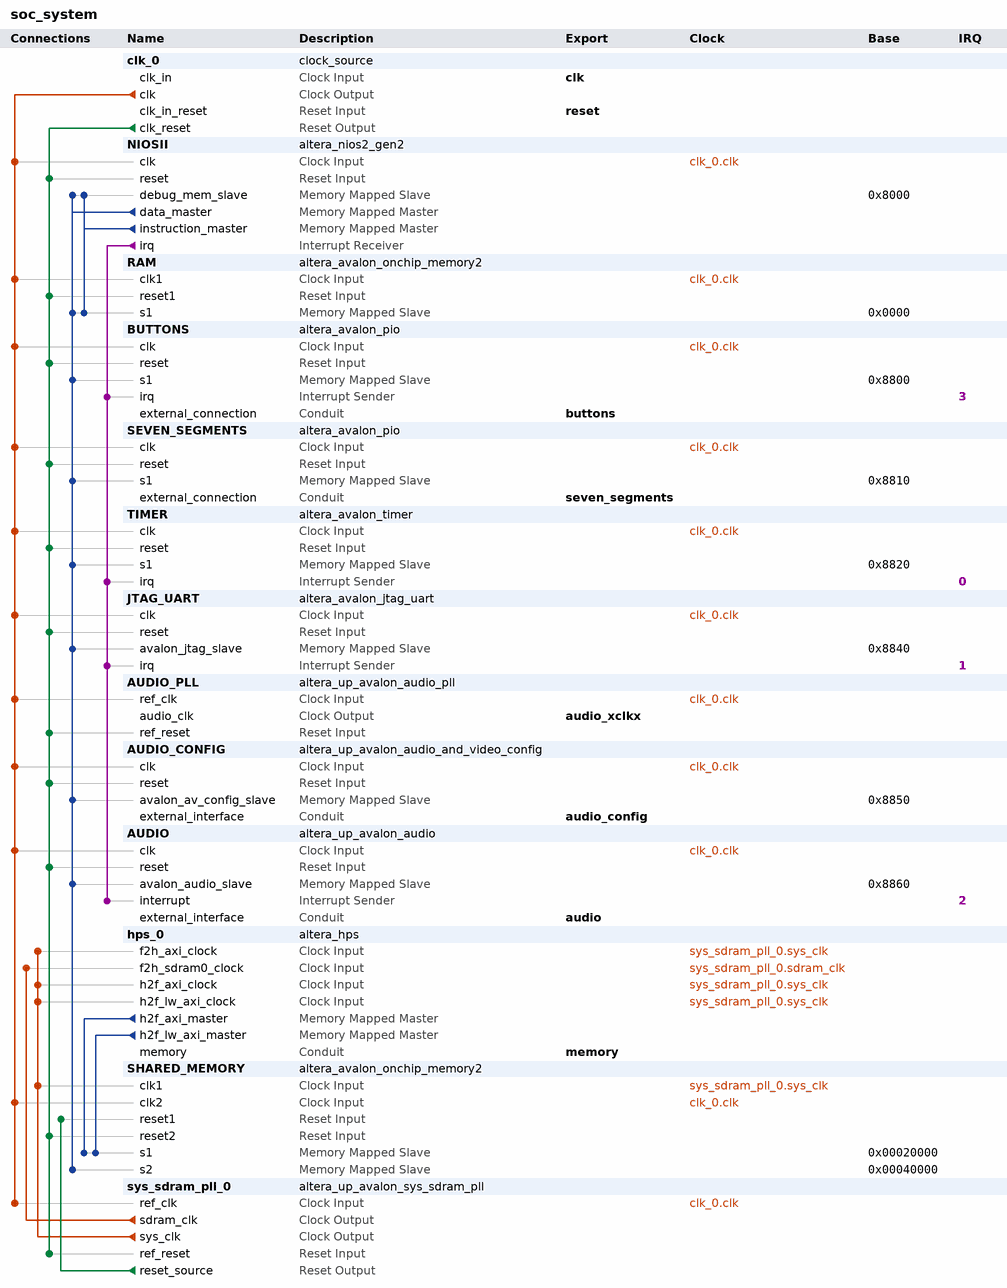
[diagram p0: system contents]
# Platform Designer (Qsys) system soc_system, Cyclone V 5CSEMA5F31C6
# Parameters at their usual value, and those the tool derives, are not listed.
package require -exact qsys 18.1
create_system soc_system
set_project_property DEVICE_FAMILY {Cyclone V}
set_project_property DEVICE 5CSEMA5F31C6

add_instance clk_0 clock_source 18.1
set_instance_parameter_value clk_0 clockFrequency 50000000

add_instance NIOSII altera_nios2_gen2 18.1
set_instance_parameter_value NIOSII dcache_size 2048
set_instance_parameter_value NIOSII exceptionSlave RAM.s1
set_instance_parameter_value NIOSII icache_size 4096
set_instance_parameter_value NIOSII impl Tiny
set_instance_parameter_value NIOSII resetSlave RAM.s1

add_instance RAM altera_avalon_onchip_memory2 18.1
set_instance_parameter_value RAM dataWidth 32
set_instance_parameter_value RAM dualPort false
set_instance_parameter_value RAM initMemContent true
set_instance_parameter_value RAM initializationFileName onchip_mem.hex
set_instance_parameter_value RAM memorySize 32768

add_instance BUTTONS altera_avalon_pio 18.1
set_instance_parameter_value BUTTONS bitClearingEdgeCapReg true
set_instance_parameter_value BUTTONS captureEdge true
set_instance_parameter_value BUTTONS direction Input
set_instance_parameter_value BUTTONS edgeType FALLING
set_instance_parameter_value BUTTONS generateIRQ true
set_instance_parameter_value BUTTONS irqType EDGE
set_instance_parameter_value BUTTONS width 3

add_instance SEVEN_SEGMENTS altera_avalon_pio 18.1
set_instance_parameter_value SEVEN_SEGMENTS direction Output
set_instance_parameter_value SEVEN_SEGMENTS width 28

add_instance TIMER altera_avalon_timer 18.1
set_instance_parameter_value TIMER fixedPeriod true
set_instance_parameter_value TIMER period 500
set_instance_parameter_value TIMER periodUnits MSEC

add_instance JTAG_UART altera_avalon_jtag_uart 18.1
set_instance_parameter_value JTAG_UART simInteractiveOptions NO_INTERACTIVE_WINDOWS

add_instance AUDIO_PLL altera_up_avalon_audio_pll 18.0
set_instance_parameter_value AUDIO_PLL gui_refclk 50.0

add_instance AUDIO_CONFIG altera_up_avalon_audio_and_video_config 18.0
set_instance_parameter_value AUDIO_CONFIG audio_in {Microphone to ADC}
set_instance_parameter_value AUDIO_CONFIG bit_length 24
set_instance_parameter_value AUDIO_CONFIG board DE1-SoC
set_instance_parameter_value AUDIO_CONFIG line_in_bypass false
set_instance_parameter_value AUDIO_CONFIG sampling_rate {48 kHz}

add_instance AUDIO altera_up_avalon_audio 18.0
set_instance_parameter_value AUDIO audio_in false
set_instance_parameter_value AUDIO avalon_bus_type {Memory Mapped}
set_instance_parameter_value AUDIO dw 24

add_instance hps_0 altera_hps 18.1
set_instance_parameter_value hps_0 EMAC1_Mode N/A
set_instance_parameter_value hps_0 EMAC1_PinMuxing Unused
set_instance_parameter_value hps_0 F2SCLK_COLDRST_Enable false
set_instance_parameter_value hps_0 F2SCLK_DBGRST_Enable false
set_instance_parameter_value hps_0 F2SCLK_WARMRST_Enable false
set_instance_parameter_value hps_0 F2SDRAM_Type AXI-3
set_instance_parameter_value hps_0 F2SDRAM_Width 64
set_instance_parameter_value hps_0 F2SINTERRUPT_Enable false
set_instance_parameter_value hps_0 F2S_Width 2
set_instance_parameter_value hps_0 FPGA_PERIPHERAL_OUTPUT_CLOCK_FREQ_EMAC0_GTX_CLK 125
set_instance_parameter_value hps_0 FPGA_PERIPHERAL_OUTPUT_CLOCK_FREQ_EMAC0_MD_CLK 2.5
set_instance_parameter_value hps_0 FPGA_PERIPHERAL_OUTPUT_CLOCK_FREQ_EMAC1_GTX_CLK 125
set_instance_parameter_value hps_0 FPGA_PERIPHERAL_OUTPUT_CLOCK_FREQ_EMAC1_MD_CLK 2.5
set_instance_parameter_value hps_0 HPS_PROTOCOL DDR3
set_instance_parameter_value hps_0 I2C0_Mode N/A
set_instance_parameter_value hps_0 I2C0_PinMuxing Unused
set_instance_parameter_value hps_0 I2C1_Mode N/A
set_instance_parameter_value hps_0 I2C1_PinMuxing Unused
set_instance_parameter_value hps_0 LWH2F_Enable true
set_instance_parameter_value hps_0 MEM_BANKADDR_WIDTH 3
set_instance_parameter_value hps_0 MEM_CLK_FREQ 300.0
set_instance_parameter_value hps_0 MEM_CLK_FREQ_MAX 400.0
set_instance_parameter_value hps_0 MEM_COL_ADDR_WIDTH 8
set_instance_parameter_value hps_0 MEM_DQ_WIDTH 8
set_instance_parameter_value hps_0 MEM_DRV_STR RZQ/6
set_instance_parameter_value hps_0 MEM_ROW_ADDR_WIDTH 12
set_instance_parameter_value hps_0 MEM_RTT_NOM {ODT Disabled}
set_instance_parameter_value hps_0 MEM_RTT_WR {Dynamic ODT off}
set_instance_parameter_value hps_0 MEM_TCL 7
set_instance_parameter_value hps_0 MEM_TFAW_NS 37.5
set_instance_parameter_value hps_0 MEM_TINIT_US 499
set_instance_parameter_value hps_0 MEM_TMRD_CK 3
set_instance_parameter_value hps_0 MEM_TRAS_NS 40.0
set_instance_parameter_value hps_0 MEM_TRCD_NS 15.0
set_instance_parameter_value hps_0 MEM_TREFI_US 7.0
set_instance_parameter_value hps_0 MEM_TRFC_NS 75.0
set_instance_parameter_value hps_0 MEM_TRP_NS 15.0
set_instance_parameter_value hps_0 MEM_TWTR 2
set_instance_parameter_value hps_0 MEM_VENDOR JEDEC
set_instance_parameter_value hps_0 MEM_WTCL 6
set_instance_parameter_value hps_0 MPU_EVENTS_Enable true
set_instance_parameter_value hps_0 QSPI_Mode N/A
set_instance_parameter_value hps_0 QSPI_PinMuxing Unused
set_instance_parameter_value hps_0 REF_CLK_FREQ 125.0
set_instance_parameter_value hps_0 S2FCLK_USER2CLK 5
set_instance_parameter_value hps_0 S2F_Width 2
set_instance_parameter_value hps_0 SDIO_Mode N/A
set_instance_parameter_value hps_0 SDIO_PinMuxing Unused
set_instance_parameter_value hps_0 SPIM1_Mode N/A
set_instance_parameter_value hps_0 SPIM1_PinMuxing Unused
set_instance_parameter_value hps_0 STM_Enable false
set_instance_parameter_value hps_0 TIMING_BOARD_AC_SKEW 0.02
set_instance_parameter_value hps_0 TIMING_BOARD_AC_TO_CK_SKEW 0.0
set_instance_parameter_value hps_0 TIMING_BOARD_DQ_TO_DQS_SKEW 0.0
set_instance_parameter_value hps_0 TIMING_BOARD_MAX_CK_DELAY 0.6
set_instance_parameter_value hps_0 TIMING_BOARD_MAX_DQS_DELAY 0.6
set_instance_parameter_value hps_0 TIMING_BOARD_SKEW_BETWEEN_DQS 0.02
set_instance_parameter_value hps_0 TIMING_BOARD_SKEW_CKDQS_DIMM_MAX 0.01
set_instance_parameter_value hps_0 TIMING_BOARD_SKEW_CKDQS_DIMM_MIN -0.01
set_instance_parameter_value hps_0 TIMING_BOARD_SKEW_WITHIN_DQS 0.02
set_instance_parameter_value hps_0 TIMING_TDH 125
set_instance_parameter_value hps_0 TIMING_TDQSCK 400
set_instance_parameter_value hps_0 TIMING_TDQSQ 120
set_instance_parameter_value hps_0 TIMING_TDS 50
set_instance_parameter_value hps_0 TIMING_TIH 250
set_instance_parameter_value hps_0 TIMING_TIS 175
set_instance_parameter_value hps_0 TIMING_TQSH 0.38
set_instance_parameter_value hps_0 UART0_Mode N/A
set_instance_parameter_value hps_0 UART0_PinMuxing Unused
set_instance_parameter_value hps_0 USB1_Mode N/A
set_instance_parameter_value hps_0 USB1_PinMuxing Unused
set_instance_parameter_value hps_0 desired_cfg_clk_mhz 100.0
set_instance_parameter_value hps_0 desired_qspi_clk_mhz 400.0

add_instance SHARED_MEMORY altera_avalon_onchip_memory2 18.1
set_instance_parameter_value SHARED_MEMORY dataWidth 32
set_instance_parameter_value SHARED_MEMORY dualPort true
set_instance_parameter_value SHARED_MEMORY initMemContent true
set_instance_parameter_value SHARED_MEMORY initializationFileName onchip_mem.hex
set_instance_parameter_value SHARED_MEMORY memorySize 131072

add_instance sys_sdram_pll_0 altera_up_avalon_sys_sdram_pll 18.0
set_instance_parameter_value sys_sdram_pll_0 CV_boards DE1-SoC
set_instance_parameter_value sys_sdram_pll_0 gui_outclk 300.0
set_instance_parameter_value sys_sdram_pll_0 gui_refclk 50.0

# connections
add_connection clk_0.clk AUDIO.clk clock
add_connection clk_0.clk AUDIO_CONFIG.clk clock
add_connection clk_0.clk AUDIO_PLL.ref_clk clock
add_connection clk_0.clk BUTTONS.clk clock
add_connection clk_0.clk JTAG_UART.clk clock
add_connection clk_0.clk NIOSII.clk clock
add_connection clk_0.clk RAM.clk1 clock
add_connection clk_0.clk SEVEN_SEGMENTS.clk clock
add_connection clk_0.clk SHARED_MEMORY.clk2 clock
add_connection clk_0.clk sys_sdram_pll_0.ref_clk clock
add_connection clk_0.clk TIMER.clk clock
add_connection sys_sdram_pll_0.sdram_clk hps_0.f2h_sdram0_clock clock
add_connection sys_sdram_pll_0.sys_clk hps_0.f2h_axi_clock clock
add_connection sys_sdram_pll_0.sys_clk hps_0.h2f_axi_clock clock
add_connection sys_sdram_pll_0.sys_clk hps_0.h2f_lw_axi_clock clock
add_connection sys_sdram_pll_0.sys_clk SHARED_MEMORY.clk1 clock
add_connection clk_0.clk_reset AUDIO.reset reset
add_connection clk_0.clk_reset AUDIO_CONFIG.reset reset
add_connection clk_0.clk_reset AUDIO_PLL.ref_reset reset
add_connection clk_0.clk_reset BUTTONS.reset reset
add_connection clk_0.clk_reset JTAG_UART.reset reset
add_connection clk_0.clk_reset NIOSII.reset reset
add_connection clk_0.clk_reset RAM.reset1 reset
add_connection clk_0.clk_reset SEVEN_SEGMENTS.reset reset
add_connection clk_0.clk_reset SHARED_MEMORY.reset2 reset
add_connection clk_0.clk_reset sys_sdram_pll_0.ref_reset reset
add_connection clk_0.clk_reset TIMER.reset reset
add_connection sys_sdram_pll_0.reset_source SHARED_MEMORY.reset1 reset
add_connection hps_0.h2f_axi_master SHARED_MEMORY.s1 avalon
set_connection_parameter_value hps_0.h2f_axi_master/SHARED_MEMORY.s1 baseAddress 0x00020000
add_connection hps_0.h2f_lw_axi_master SHARED_MEMORY.s1 avalon
set_connection_parameter_value hps_0.h2f_lw_axi_master/SHARED_MEMORY.s1 baseAddress 0x00020000
add_connection NIOSII.data_master AUDIO.avalon_audio_slave avalon
set_connection_parameter_value NIOSII.data_master/AUDIO.avalon_audio_slave baseAddress 0x8860
add_connection NIOSII.data_master AUDIO_CONFIG.avalon_av_config_slave avalon
set_connection_parameter_value NIOSII.data_master/AUDIO_CONFIG.avalon_av_config_slave baseAddress 0x8850
add_connection NIOSII.data_master BUTTONS.s1 avalon
set_connection_parameter_value NIOSII.data_master/BUTTONS.s1 baseAddress 0x8800
add_connection NIOSII.data_master JTAG_UART.avalon_jtag_slave avalon
set_connection_parameter_value NIOSII.data_master/JTAG_UART.avalon_jtag_slave baseAddress 0x8840
add_connection NIOSII.data_master NIOSII.debug_mem_slave avalon
set_connection_parameter_value NIOSII.data_master/NIOSII.debug_mem_slave baseAddress 0x8000
add_connection NIOSII.data_master RAM.s1 avalon
set_connection_parameter_value NIOSII.data_master/RAM.s1 baseAddress 0x0000
add_connection NIOSII.data_master SEVEN_SEGMENTS.s1 avalon
set_connection_parameter_value NIOSII.data_master/SEVEN_SEGMENTS.s1 baseAddress 0x8810
add_connection NIOSII.data_master SHARED_MEMORY.s2 avalon
set_connection_parameter_value NIOSII.data_master/SHARED_MEMORY.s2 baseAddress 0x00040000
add_connection NIOSII.data_master TIMER.s1 avalon
set_connection_parameter_value NIOSII.data_master/TIMER.s1 baseAddress 0x8820
add_connection NIOSII.instruction_master NIOSII.debug_mem_slave avalon
set_connection_parameter_value NIOSII.instruction_master/NIOSII.debug_mem_slave baseAddress 0x8000
add_connection NIOSII.instruction_master RAM.s1 avalon
set_connection_parameter_value NIOSII.instruction_master/RAM.s1 baseAddress 0x0000
add_connection NIOSII.irq AUDIO.interrupt interrupt
set_connection_parameter_value NIOSII.irq/AUDIO.interrupt irqNumber 2
add_connection NIOSII.irq BUTTONS.irq interrupt
set_connection_parameter_value NIOSII.irq/BUTTONS.irq irqNumber 3
add_connection NIOSII.irq JTAG_UART.irq interrupt
set_connection_parameter_value NIOSII.irq/JTAG_UART.irq irqNumber 1
add_connection NIOSII.irq TIMER.irq interrupt
set_connection_parameter_value NIOSII.irq/TIMER.irq irqNumber 0

# exported interfaces
add_interface audio conduit end
set_interface_property audio EXPORT_OF AUDIO.external_interface
add_interface audio_config conduit end
set_interface_property audio_config EXPORT_OF AUDIO_CONFIG.external_interface
add_interface audio_xclkx clock source
set_interface_property audio_xclkx EXPORT_OF AUDIO_PLL.audio_clk
add_interface buttons conduit end
set_interface_property buttons EXPORT_OF BUTTONS.external_connection
add_interface clk clock sink
set_interface_property clk EXPORT_OF clk_0.clk_in
add_interface memory conduit end
set_interface_property memory EXPORT_OF hps_0.memory
add_interface reset reset sink
set_interface_property reset EXPORT_OF clk_0.clk_in_reset
add_interface seven_segments conduit end
set_interface_property seven_segments EXPORT_OF SEVEN_SEGMENTS.external_connection

set_interconnect_requirement {$system} qsys_mm.clockCrossingAdapter HANDSHAKE
set_interconnect_requirement {$system} qsys_mm.enableEccProtection FALSE
set_interconnect_requirement {$system} qsys_mm.insertDefaultSlave FALSE
set_interconnect_requirement {$system} qsys_mm.maxAdditionalLatency 1

save_system soc_system.qsys
